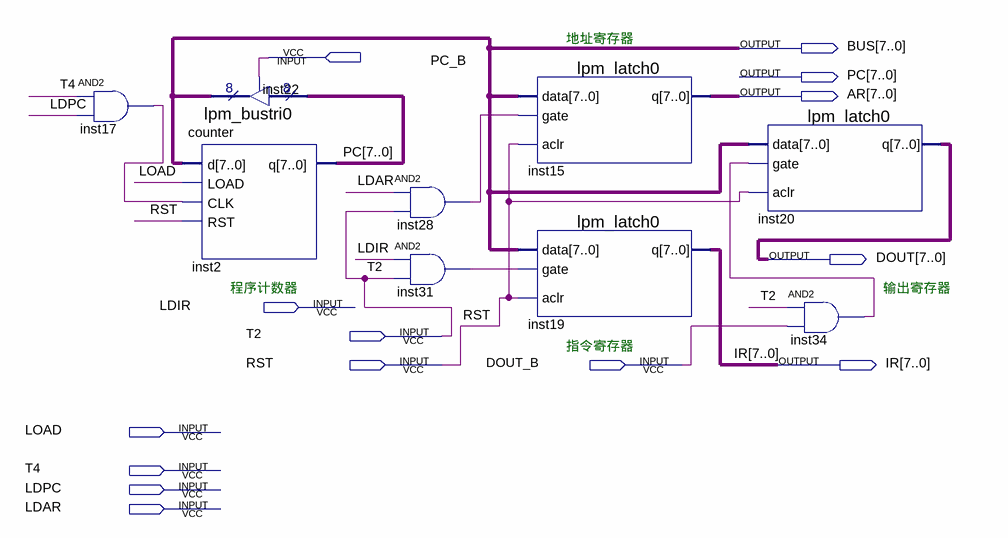
[diagram p0: schematic sheet]
// Quartus schematic REGS_MD.bdf as structural Verilog: 9 symbols, 14 pins
module REGS_MD (
  input  PC_B,
  input  LDIR,
  input  T2,
  input  RST,
  input  DOUT_B,
  input  LOAD,
  input  T4,
  input  LDPC,
  input  LDAR,
  output [7:0] BUS,
  output [7:0] PC,
  output [7:0] AR,
  output [7:0] DOUT,
  output [7:0] IR
);

  wire inst17_out, inst28_out, inst31_out, inst34_out;

  and inst17 (inst17_out, T4, LDPC);
  lpm_bustri0 inst22 (.enabledt(PC_B), .data(PC), .tridata(BUS));
  counter inst2 (.d(BUS), .LOAD(LOAD), .CLK(inst17_out), .RST(RST), .q(PC));
  and inst28 (inst28_out, LDAR, T2);
  and inst31 (inst31_out, LDIR, T2);
  lpm_latch0 inst15 (.data(BUS), .gate(inst28_out), .aclr(RST), .q(AR));
  lpm_latch0 inst19 (.data(BUS), .gate(inst31_out), .aclr(RST), .q(IR));
  lpm_latch0 inst20 (.data(BUS), .gate(inst34_out), .aclr(RST), .q(DOUT));
  and inst34 (inst34_out, T2, DOUT_B);

  // Notes on the sheet:
  //   地址寄存器
  //   程序计数器
  //   输出寄存器
  //   指令寄存器
endmodule
